# EAGLE schematic usb_levalaszto_v1 (EAGLE 6.5.0)
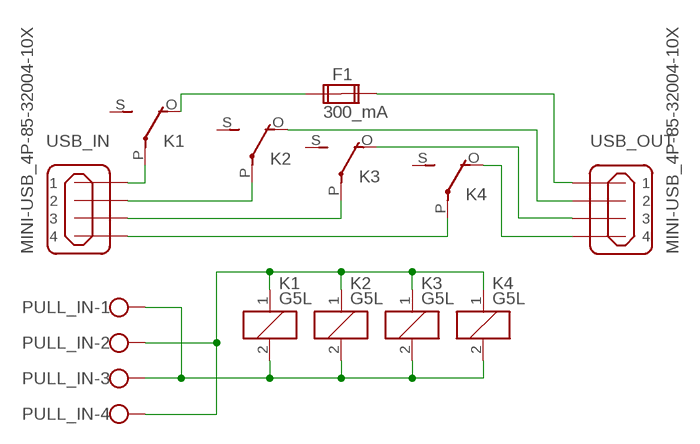
[diagram p0: schematic, sheet 1]

## Parts
F1  300_mA  FUSE2P  [FUSE1]
K1  G5L  [G5LE]
K2  G5L  [G5LE]
K3  G5L  [G5LE]
K4  G5L  [G5LE]
PULL_IN  W237-4  [W237-4]
USB_IN  MINI-USB_4P-85-32004-10X  [85-32004-10X]
USB_OUT  MINI-USB_4P-85-32004-10X  [85-32004-10X]

## Nets
N$1: K1.P(2:P) USB_IN.1
N$2: K2.P(2:P) USB_IN.2
N$3: K3.P(2:P) USB_IN.3
N$4: K4.P(2:P) USB_IN.4
N$5: K4.O(2:O) USB_OUT.4
N$6: K3.O(2:O) USB_OUT.3
N$7: K2.O(2:O) USB_OUT.2
N$8: F1.2A USB_OUT.1
N$9: K1.1 K2.1 K3.1 K4.1 PULL_IN.2 PULL_IN.4
N$10: K1.2 K2.2 K3.2 K4.2 PULL_IN.1 PULL_IN.3
N$11: F1.1A K1.O(2:O)
Unconnected: F1.1B F1.2B K1.S(2:S) K2.S(2:S) K3.S(2:S) K4.S(2:S)

## Library data of the parts
F1 = special:FUSE2P: FUSE 5 x 20 mm
K1-K4 = relay:G5L: RELAY 1 x switch, 10 A/120 V AC, 8 A/30 V ADC, Omron; OC_FARNELL: unknown; OC_NEWARK: unknown
PULL_IN = con-wago-500:W237-4: WAGO SCREW CLAMP; OC_FARNELL: unknown; OC_NEWARK: unknown
USB_IN USB_OUT = con-cypressindustries:MINI-USB_4P-: MINI USB 4 Pol. Source: www.cypressindustries.com; OC_FARNELL: unknown; OC_NEWARK: unknown